# EAGLE design MAD (EAGLE 8.2.2)
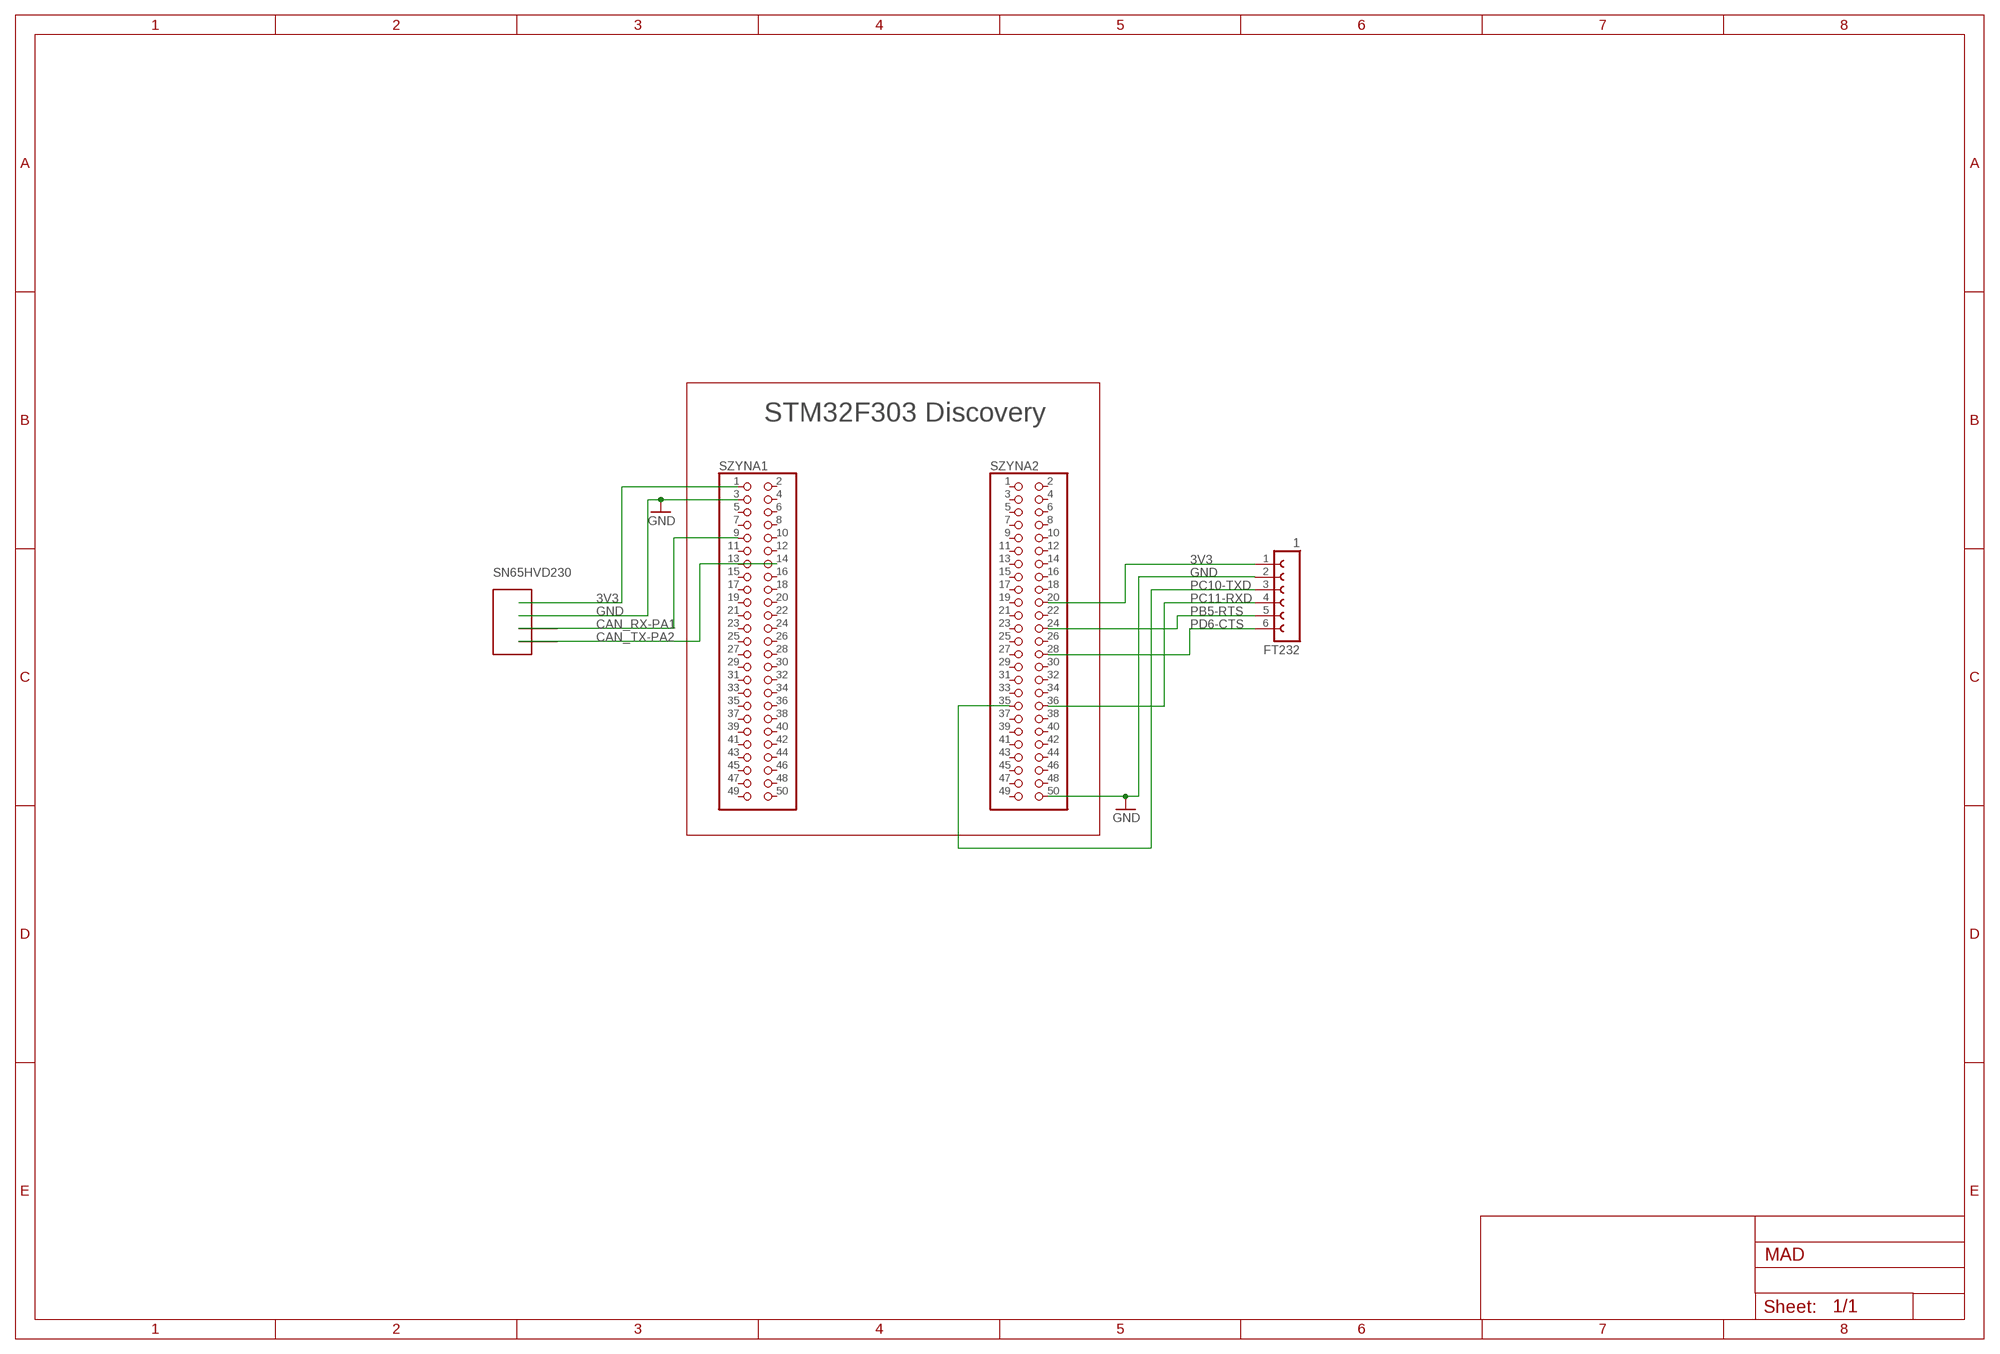
[diagram p0: schematic, sheet 1]

## Parts
FT232  1  FE06W  [FE06W]
SN65HVD230  FE04W  [FE04]
SZYNA1  PINHD-2X25  [2X25]
SZYNA2  PINHD-2X25  [2X25]

## Nets
3V3: SN65HVD230.P$1 SZYNA1.1
3V3_2: FT232.1 SZYNA2.20
CAN_RX-PA1: SN65HVD230.P$3 SZYNA1.9
CAN_TX-PA2: SN65HVD230.P$4 SZYNA1.14
GND: FT232.2 SN65HVD230.P$2 SZYNA1.3 SZYNA2.50
PB5-RTS: FT232.5 SZYNA2.24
PC10-TXD: FT232.3 SZYNA2.35
PC11-RXD: FT232.4 SZYNA2.36
PD6-CTS: FT232.6 SZYNA2.28
Unconnected: SZYNA1.2 SZYNA1.4 SZYNA1.5 SZYNA1.6 SZYNA1.7 SZYNA1.8 SZYNA1.10 SZYNA1.11 SZYNA1.12 SZYNA1.13 SZYNA1.15 SZYNA1.16 SZYNA1.17 SZYNA1.18 SZYNA1.19 SZYNA1.20 SZYNA1.21 SZYNA1.22 SZYNA1.23 SZYNA1.24 SZYNA1.25 SZYNA1.26 SZYNA1.27 SZYNA1.28 SZYNA1.29 SZYNA1.30 SZYNA1.31 SZYNA1.32 SZYNA1.33 SZYNA1.34 SZYNA1.35 SZYNA1.36 SZYNA1.37 SZYNA1.38 SZYNA1.39 SZYNA1.40 SZYNA1.41 SZYNA1.42 SZYNA1.43 SZYNA1.44 SZYNA1.45 SZYNA1.46 SZYNA1.47 SZYNA1.48 SZYNA1.49 SZYNA1.50 SZYNA2.1 SZYNA2.2 SZYNA2.3 SZYNA2.4 SZYNA2.5 SZYNA2.6 SZYNA2.7 SZYNA2.8 SZYNA2.9 SZYNA2.10 SZYNA2.11 SZYNA2.12 SZYNA2.13 SZYNA2.14 SZYNA2.15 SZYNA2.16 SZYNA2.17 SZYNA2.18 SZYNA2.19 SZYNA2.21 SZYNA2.22 SZYNA2.23 SZYNA2.25 SZYNA2.26 SZYNA2.27 SZYNA2.29 SZYNA2.30 SZYNA2.31 SZYNA2.32 SZYNA2.33 SZYNA2.34 SZYNA2.37 SZYNA2.38 SZYNA2.39 SZYNA2.40 SZYNA2.41 SZYNA2.42 SZYNA2.43 SZYNA2.44 SZYNA2.45 SZYNA2.46 SZYNA2.47 SZYNA2.48 SZYNA2.49

## Notes on the sheet
- STM32F303 Discovery
- 3V3
- SN65HVD230 | GND
- PC10-TXD
- 3V3 | PC11-RXD
- GND | PB5-RTS
- CAN_RX-PA1 | PD6-CTS
- CAN_TX-PA2

## Library data of the parts
FT232 = con-lsta:FE06W: FEMALE HEADER; OC_FARNELL: unknown; OC_NEWARK: unknown
SN65HVD230 = FE4W:FE04W
SZYNA1 SZYNA2 = pinhead:PINHD-2X25: PIN HEADER

## Board
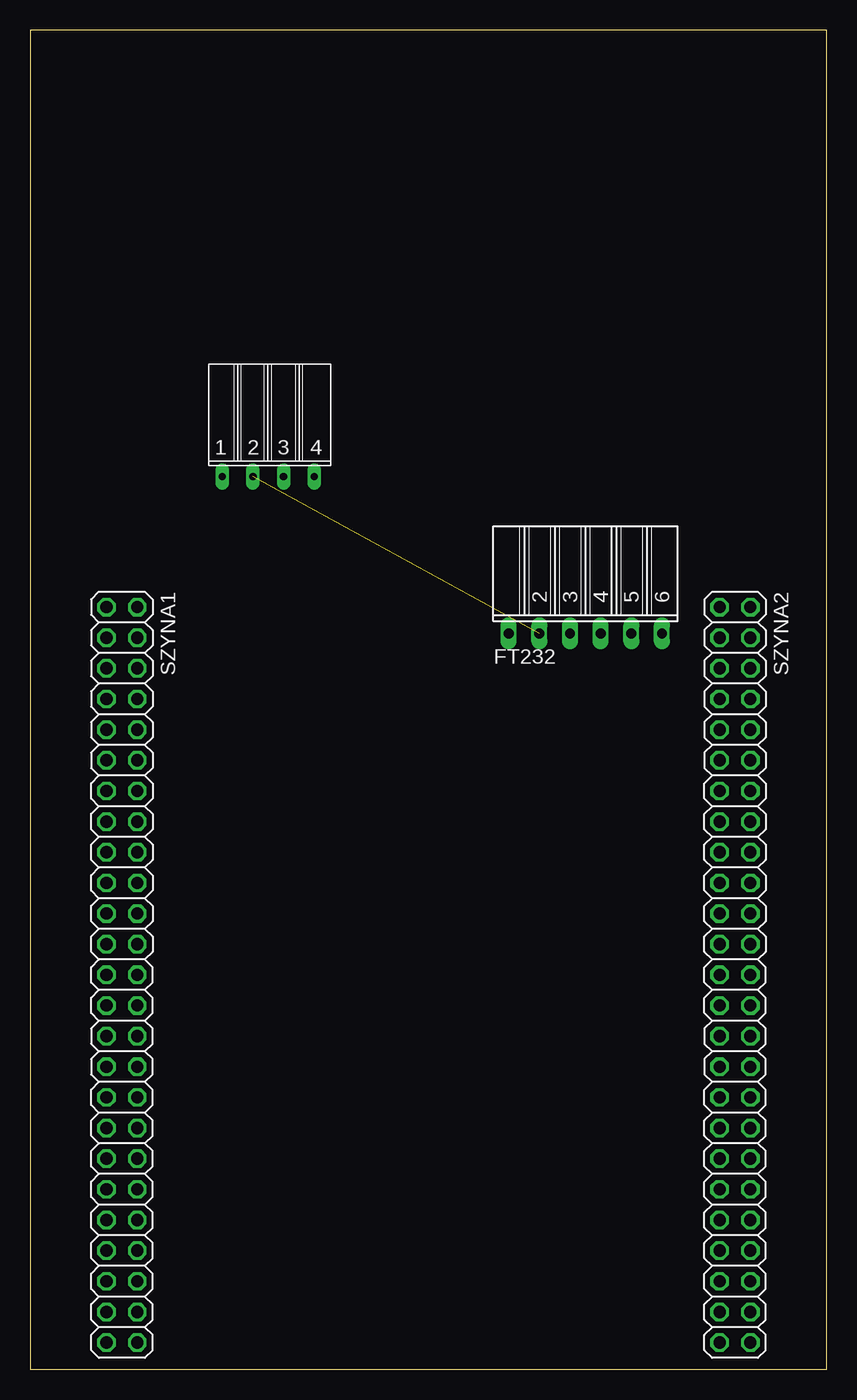
[diagram p1: board, top side]
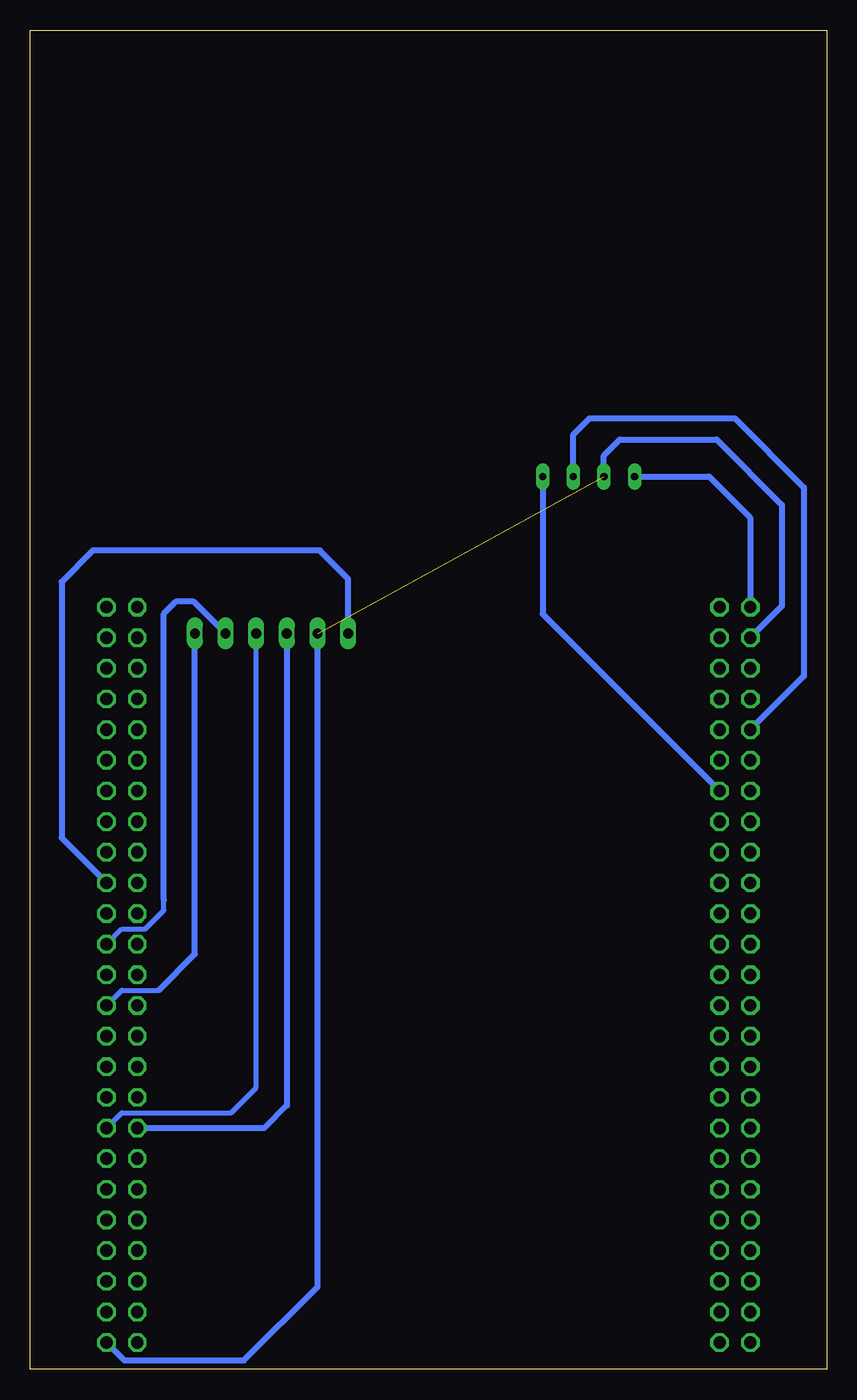
[diagram p2: board, bottom side, seen from below]

Size 66 x 111 mm. Coordinates in mm from the lower left corner, seen from the top.
Outline: 0,0 66,0 66,111 0,111 0,0
Copper layers (1*16): Top 0.035mm / dielectric 1.5mm / Bottom 0.035mm
Design rules "default": minimum track width 6mil, minimum drill 0.35mm, track to track 6mil, track to pad 6mil, pad to pad 6mil, via to via 6mil, smd to smd 6mil, copper to edge 40mil, drill to drill 6mil, minimum pad ring 10mil, minimum via ring 8mil, stop-mask expansion 4mil, vias tented up to drill 0mil, thermal gap 10mil

### Footprints (pad centres in the part's own frame; a part is rotated, then mirrored left to right if it is on the bottom)
FE06W = drill 0.813 long: 1 -6.35,0; 2 -3.81,0; 3 -1.27,0; 4 1.27,0; 5 3.81,0; 6 6.35,0
FE04 = drill 0.6 long: P$1 -5.08,0; P$2 -2.54,0; P$3 0,0; P$4 2.54,0
2X25 = drill 1.016 octagon: 1 -30.48,-1.27; 2 -30.48,1.27; 3 -27.94,-1.27; 4 -27.94,1.27; 5 -25.4,-1.27; 6 -25.4,1.27; 7 -22.86,-1.27; 8 -22.86,1.27; 9 -20.32,-1.27; 10 -20.32,1.27; 11 -17.78,-1.27; 12 -17.78,1.27; 13 -15.24,-1.27; 14 -15.24,1.27; 15 -12.7,-1.27; 16 -12.7,1.27; 17 -10.16,-1.27; 18 -10.16,1.27; 19 -7.62,-1.27; 20 -7.62,1.27; 21 -5.08,-1.27; 22 -5.08,1.27; 23 -2.54,-1.27; 24 -2.54,1.27; 25 0,-1.27; 26 0,1.27; 27 2.54,-1.27; 28 2.54,1.27; 29 5.08,-1.27; 30 5.08,1.27; 31 7.62,-1.27; 32 7.62,1.27; 33 10.16,-1.27; 34 10.16,1.27; 35 12.7,-1.27; 36 12.7,1.27; 37 15.24,-1.27; 38 15.24,1.27; 39 17.78,-1.27; 40 17.78,1.27; 41 20.32,-1.27; 42 20.32,1.27; 43 22.86,-1.27; 44 22.86,1.27; 45 25.4,-1.27; 46 25.4,1.27; 47 27.94,-1.27; 48 27.94,1.27; 49 30.48,-1.27; 50 30.48,1.27

### Placement (x,y rotation side)
FT232  46,61 0 top
SN65HVD230  21,74 0 top
SZYNA1  7.6,32.7 270 top
SZYNA2  58.4,32.7 270 top

### Tracks (layer width: path | path; a pad name or v marks a point on that pad's centre or on a via)
3V3
  Bottom 0.508: SN65HVD230.P$1 9.74,74 6.34,70.6 SZYNA1.1
3V3_2
  Bottom 0.508: FT232.1 39.65,65.52 42,67.87 60.8,67.87 63.4,65.27 63.4,44.05 SZYNA2.20
CAN_RX-PA1
  Bottom 0.508: SN65HVD230.P$3 21,77.48 19.64,78.84 7.64,78.84 1.9,73.1 1.9,57.45 SZYNA1.9
CAN_TX-PA2
  Bottom 0.508: SN65HVD230.P$4 23.54,62.61 SZYNA1.14
GND  (1 unrouted)
  Bottom 0.508: SN65HVD230.P$2 18.46,75.75 17.14,77.07 9.13,77.07 3.71,71.65 3.71,63.26 SZYNA1.3 | SZYNA2.50 58.2,0.75 48.29,0.75 42.19,6.85 FT232.2
PB5-RTS
  Bottom 0.406: SZYNA2.24 58.41,36.5 56.47,36.5 54.93,38.04 54.93,38.9
  Bottom 0.508: FT232.5 52.45,63.64 53.93,63.64 54.93,62.64 54.93,38.9
PC10-TXD
  Bottom 0.508: FT232.3 44.73,21.88 46.62,19.99 SZYNA2.35
PC11-RXD
  Bottom 0.406: SZYNA2.36 58.4,21.27 49.35,21.27 47.27,23.35 FT232.4
PD6-CTS
  Bottom 0.406: SZYNA2.28 58.41,31.42 55.35,31.42
  Bottom 0.508: 55.35,31.42 52.35,34.42 FT232.6